# Altium schematic sheet Misc.SchDoc
size A3; PageSetup: Record=PageOptions|CenterHorizontal=True|CenterVertical=True|PrintScale=0.96|XCorrection=1.00|YCorrection=1.00|PrintKind=2|BorderSize=5000000|LeftOffset=0|BottomOffset=0|Orientation=2|PaperLength=1000|PaperWidth=1000|Scale=100|PaperSource=7|PrintQuality=-4|MediaType=1|DitherType=10|PaperKind=A4|PrintScaleMode=1
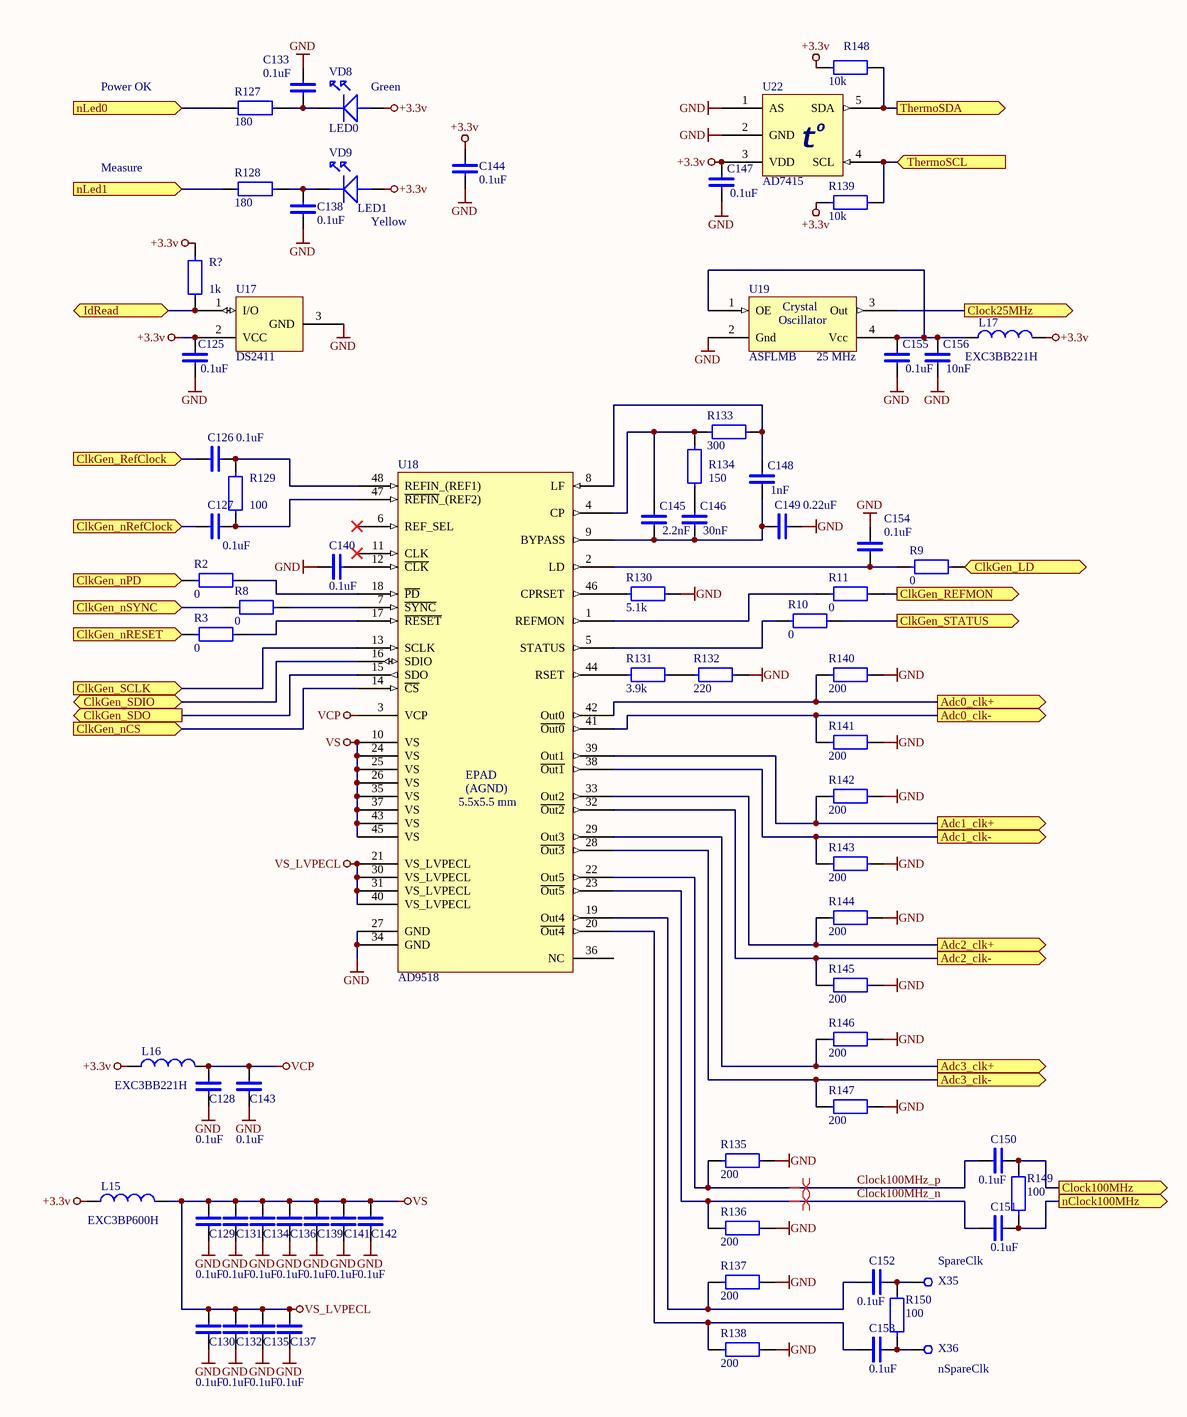
[diagram p0: Misc.SchDoc]

## Parts
C125  0.1uF  [0603]
C126  0.1uF  [0402]
C127  0.1uF  [0402]
C128  0.1uF  [0402]
C129  0.1uF  [0402]
C130  0.1uF  [0402]
C131  0.1uF  [0402]
C132  0.1uF  [0402]
C133  0.1uF  [0603]
C134  0.1uF  [0402]
C135  0.1uF  [0402]
C136  0.1uF  [0402]
C137  0.1uF  [0402]
C138  0.1uF  [0603]
C139  0.1uF  [0402]
C140  0.1uF  [0402]
C141  0.1uF  [0402]
C142  0.1uF  [0402]
C143  0.1uF  [0402]
C144  0.1uF  [0603]
C145  2.2nF  [0603]
C146  30nF  [0603]
C147  0.1uF  [0603]
C148  1nF  [0603]
C149  0.22uF  [0603]
C150  0.1uF  [0402]
C151  0.1uF  [0402]
C152  0.1uF  [0402]
C153  0.1uF  [0402]
C154  0.1uF  [0603]
C155  0.1uF  [0603]
C156  10nF  [0603]
L15  EXC3BP600H  [0603]
L16  EXC3BB221H  [0603]
L17  EXC3BB221H  [0603]
R2  0  [0603]
R3  0  [0603]
R8  0  [0603]
R9  0  [0603]
R10  0  [0603]
R11  0  [0603]
R127  180  [0805]
R128  180  [0805]
R129  100  [0402]
R130  5.1k  [0603]
R131  3.9k  [0603]
R132  220  [0603]
R133  300  [0603]
R134  150  [0603]
R135  200  [0603]
R136  200  [0603]
R137  200  [0603]
R138  200  [0603]
R139  10k  [0603]
R140  200  [0603]
R141  200  [0603]
R142  200  [0603]
R143  200  [0603]
R144  200  [0603]
R145  200  [0603]
R146  200  [0603]
R147  200  [0603]
R148  10k  [0603]
R149  100  [0402]
R150  100  [0402]
R?  1k  [0402]
U17  DS2411  [SOT-23]
U18  AD9518  [48LFCSP]
U19  ASFLMB  [KXO-V99]
U22  AD7415  [SOT-23-5]
VD8  LED0  [LED2]
VD9  LED1  [LED2]
X35  SpareClk  [DRL06]
X36  nSpareClk  [DRL06]

## Ports
Adc0_clk+ (out), Adc0_clk- (out), Adc1_clk+ (out), Adc1_clk- (out), Adc2_clk+ (out), Adc2_clk- (out), Adc3_clk+ (out), Adc3_clk- (out), ClkGen_LD (out), ClkGen_nCS (in), ClkGen_nPD (in), ClkGen_nRefClock (in), ClkGen_nRESET (in), ClkGen_nSYNC (in), ClkGen_RefClock (in), ClkGen_REFMON (out), ClkGen_SCLK (in), ClkGen_SDIO (bidir), ClkGen_SDO (out), ClkGen_STATUS (out), Clock25MHz (out), Clock100MHz (out), IdRead (bidir), nClock100MHz (out), nLed0 (in), nLed1 (in), ThermoSCL (in), ThermoSDA (out)

## Nets
+3.3v: C125.2 C144.1 C147.2 L15.1 L16.1 L17.2 R139.2 R148.2 R?.2 U17.2(VCC) U22.3(VDD) VD8.ANODE VD9.ANODE
GND: C125.1 C128.1 C129.1 C130.1 C131.1 C132.1 C133.1 C134.1 C135.1 C136.1 C137.1 C138.2 C139.1 C140.1 C141.1 C142.1 C143.1 C144.2 C147.1 C149.1 C154.1 C155.1 C156.1 R130.1 R132.1 R135.1 R136.1 R137.1 R138.1 R140.1 R141.1 R142.1 R143.1 R144.1 R145.1 R146.1 R147.1 U17.3(GND) U18.27(GND) U18.34(GND) U19.2(Gnd) U22.1(AS) U22.2(GND)
VCP: C128.2 C143.2 L16.2 U18.3(VCP)
VS: C129.2 C130.2 C131.2 C132.2 C134.2 C135.2 C136.2 C137.2 C139.2 C141.2 C142.2 L15.2 U18.10(VS) U18.21(VS_LVPECL) U18.24(VS) U18.25(VS) U18.26(VS) U18.30(VS_LVPECL) U18.31(VS_LVPECL) U18.35(VS) U18.37(VS) U18.40(VS_LVPECL) U18.43(VS) U18.45(VS)  [also labelled VS_LVPECL]
Adc0_clk+: R140.2 U18.42(Out0) ; port Adc0_clk+
Adc0_clk-: R141.2 U18.41(~{Out0}) ; port Adc0_clk-
Adc1_clk+: R142.2 U18.39(Out1) ; port Adc1_clk+
Adc1_clk-: R143.2 U18.38(~{Out1}) ; port Adc1_clk-
Adc2_clk+: R144.2 U18.33(Out2) ; port Adc2_clk+
Adc2_clk-: R145.2 U18.32(~{Out2}) ; port Adc2_clk-
Adc3_clk+: R146.2 U18.29(Out3) ; port Adc3_clk+
Adc3_clk-: R147.2 U18.28(~{Out3}) ; port Adc3_clk-
ClkGen_LD: R9.1 ; port ClkGen_LD
ClkGen_nCS: U18.14(~{CS}) ; port ClkGen_nCS
ClkGen_nPD: R2.2 ; port ClkGen_nPD
ClkGen_nRefClock: C127.2 ; port ClkGen_nRefClock
ClkGen_nRESET: R3.2 ; port ClkGen_nRESET
ClkGen_nSYNC: R8.2 ; port ClkGen_nSYNC
ClkGen_RefClock: C126.2 ; port ClkGen_RefClock
ClkGen_REFMON: R11.1 ; port ClkGen_REFMON
ClkGen_SCLK: U18.13(SCLK) ; port ClkGen_SCLK
ClkGen_SDIO: U18.16(SDIO) ; port ClkGen_SDIO
ClkGen_SDO: U18.15(SDO) ; port ClkGen_SDO
ClkGen_STATUS: R10.1 ; port ClkGen_STATUS
Clock25MHz: U19.3(Out) ; port Clock25MHz
Clock100MHz: C150.2 R149.1 ; port Clock100MHz
Clock100MHz_n: C151.1 R136.2 U18.23(~{Out5})
Clock100MHz_p: C150.1 R135.2 U18.22(Out5)
IdRead: R?.1 U17.1(I/O) ; port IdRead
nClock100MHz: C151.2 R149.2 ; port nClock100MHz
nLed0: R127.1 ; port nLed0
nLed1: R128.1 ; port nLed1
ThermoSCL: R139.1 U22.4(SCL) ; port ThermoSCL
ThermoSDA: R148.1 U22.5(SDA) ; port ThermoSDA
NetC126_1: C126.1 R129.2 U18.48(REFIN_(REF1))
NetC127_1: C127.1 R129.1 U18.47(~{REFIN}_(REF2))
NetC133_2: C133.2 R127.2 VD8.CATHODE
NetC138_1: C138.1 R128.2 VD9.CATHODE
NetC140_2: C140.2 U18.12(~{CLK})
NetC145_1: C145.1 C146.1 C148.1 C149.2 U18.9(BYPASS)
NetC145_2: C145.2 R133.2 R134.2 U18.4(CP)
NetC146_2: C146.2 R134.1
NetC148_2: C148.2 R133.1 U18.8(LF)
NetC152_1: C152.1 R137.2 U18.19(Out4)
NetC152_2: C152.2 R150.1 X35.DRIL
NetC153_1: C153.1 R138.2 U18.20(~{Out4})
NetC153_2: C153.2 R150.2 X36.DRIL
NetC154_2: C154.2 R9.2 U18.2(LD)
NetC155_2: C155.2 C156.2 L17.1 U19.1(OE) U19.4(Vcc)
NetR2_1: R2.1 U18.18(~{PD})
NetR3_1: R3.1 U18.17(~{RESET})
NetR8_1: R8.1 U18.7(~{SYNC})
NetR10_2: R10.2 U18.5(STATUS)
NetR11_2: R11.2 U18.1(REFMON)
NetR130_2: R130.2 U18.46(CPRSET)
NetR131_1: R131.1 R132.2
NetR131_2: R131.2 U18.44(RSET)

Not connected (* = marked no-connect by the designer): U18 6(REF_SEL)* 11(CLK)* 36(NC)

## Layout directives
differential pair: Clock100MHz_n, Clock100MHz_p

## Notes on the sheet
- Power OK
- (near VD8) Green
- Measure
- (near VD9) Yellow
- (near U19) 25 MHz
- (in symbol AD7415) o; t
- (in symbol AD9518) EPAD; (AGND); 5.5x5.5 mm
- (in symbol ASFLMB) Crystal; Oscillator

## Library data of the parts
C125 C128-C149 C154-C156 = C
C126 C127 C150-C153 = c
L15-L17 = INDUCTOR
R2 R3 R8-R11 R129-R150 R? = r
R127 R128 = R
U17 = DS2411: Silicon Serial Number
U18 = AD9518: 6-Output Clock Generator with  Integrated 1.6 GHz VCO
U19 = ASFLMB: Crystal Oscillator (SMD)
U22 = AD7415: 10-Bit Digital Temperature Sensors
VD8 = LED1
X35 X36 = DRL